# EAGLE design MicroLRS (EAGLE 7.5.0)
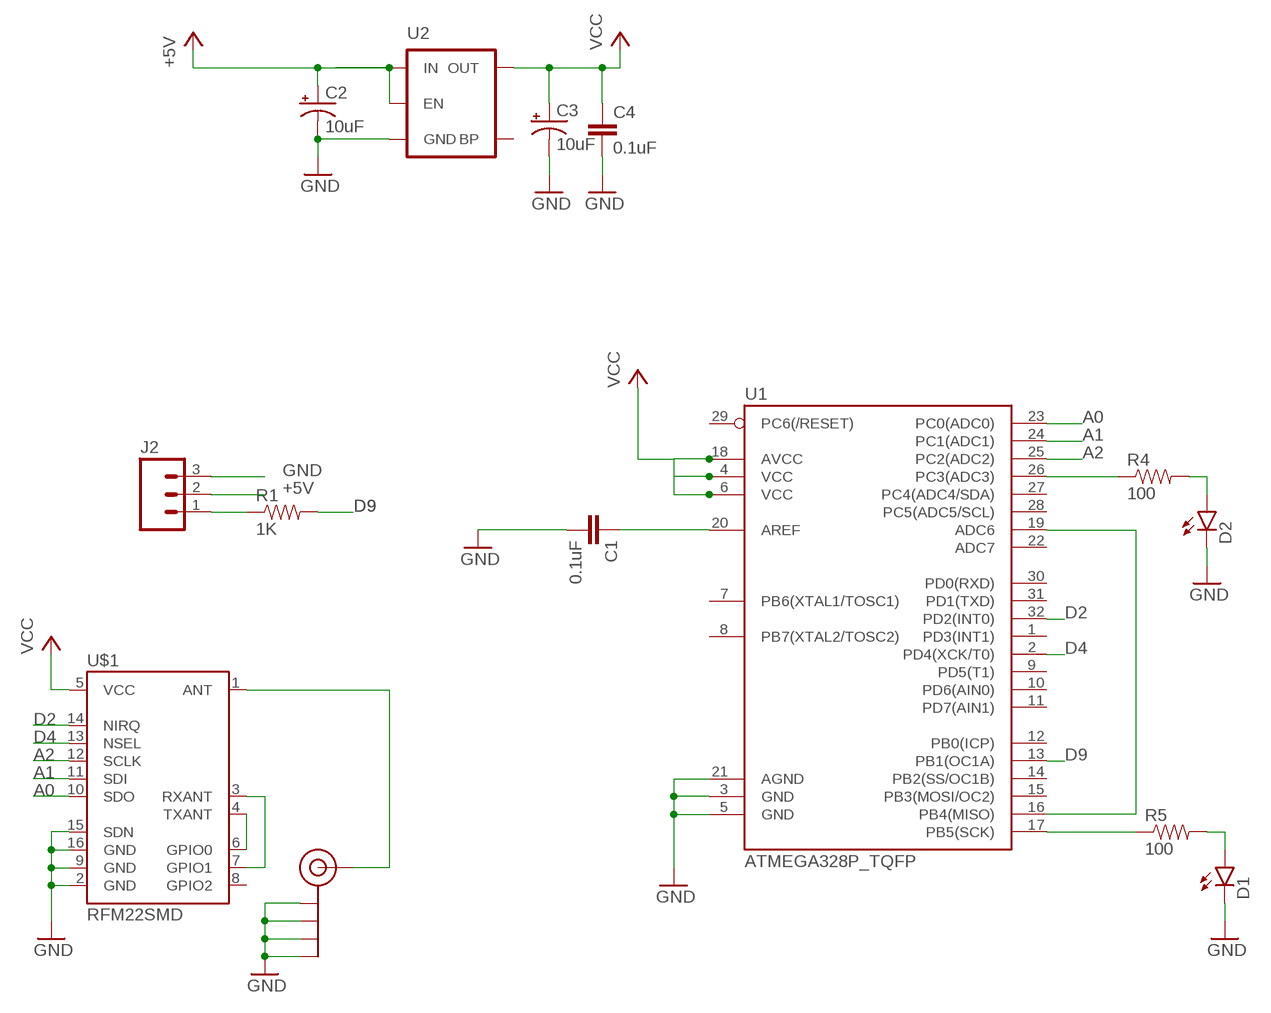
[diagram p0: schematic, sheet 1]

## Parts
C1  0.1uF  0.1UF-16V(+-10%)(0402)  [0402-CAP]
C2  10uF  10UF-6.3V-20%(0603)(TANT)"  [0603-POL]
C3  10uF  10UF-6.3V-20%(0603)(TANT)"  [0603-POL]
C4  0.1uF  0.1UF-25V-5%(0603)  [0603-CAP]
D1  LED0603  [LED-0603]
D2  LED0603  [LED-0603]
J2  M03PTH  [1X03]
J$1  SMA_EDGE  [SMA-EDGE]
R1  1K  1KOHM-1/10W-1%(0603)  [0603-RES]
R4  100  100OHM-1/10W-1%(0603)  [0603-RES]
R5  100  100OHM-1/10W-1%(0603)  [0603-RES]
U1  ATMEGA328P_TQFP  [TQFP32-08]
U2  MIC52053.3V  [SOT23-5]
U$1  RFM22SMD  [RFM22-XXX-S2]

## Nets
+5V: C2.A(+) J2.2 U2.1(IN) U2.3(EN)
A0: U1.23(PC0(ADC0)) U$1.10(SDO)
A1: U1.24(PC1(ADC1)) U$1.11(SDI)
A2: U1.25(PC2(ADC2)) U$1.12(SCLK)
D2: U1.32(PD2(INT0)) U$1.14(NIRQ)
D4: U1.2(PD4(XCK/T0)) U$1.13(NSEL)
D9: R1.2 U1.13(PB1(OC1A))
GND: C1.2 C2.K(-) C3.K(-) C4.2 D1.C D2.C J2.3 J$1.GND@0(GND) J$1.GND@1(GND) J$1.GND@2(GND) J$1.GND@3(GND) U1.3(GND) U1.5(GND) U1.21(AGND) U2.2(GND) U$1.2(GND) U$1.9(GND) U$1.15(SDN) U$1.16(GND)
N$1: C1.1 U1.20(AREF)
N$2: J$1.SIG(SIGNAL) U$1.1(ANT)
N$3: U$1.4(TXANT) U$1.6(GPIO0)
N$4: U$1.3(RXANT) U$1.7(GPIO1)
N$9: U1.16(PB4(MISO)) U1.19(ADC6)
N$10: J2.1 R1.1
N$11: R4.1 U1.26(PC3(ADC3))
N$12: R5.1 U1.17(PB5(SCK))
N$13: D2.A R4.2
N$14: D1.A R5.2
VCC: C3.A(+) C4.1 U1.4(VCC) U1.6(VCC) U1.18(AVCC) U2.5(OUT) U$1.5(VCC)
Unconnected: U1.1(PD3(INT1)) U1.7(PB6(XTAL1/TOSC1)) U1.8(PB7(XTAL2/TOSC2)) U1.9(PD5(T1)) U1.10(PD6(AIN0)) U1.11(PD7(AIN1)) U1.12(PB0(ICP)) U1.14(PB2(SS/OC1B)) U1.15(PB3(MOSI/OC2)) U1.22(ADC7) U1.27(PC4(ADC4/SDA)) U1.28(PC5(ADC5/SCL)) U1.29(PC6(/RESET)) U1.30(PD0(RXD)) U1.31(PD1(TXD)) U2.4(BP) U$1.8(GPIO2)

## Library data of the parts
C1 = SparkFun-Capacitors:0.1UF-16V(+-10%)(0402); PROD_ID: CAP-12416
C2 C3 = SparkFun-Capacitors:10UF-6.3V-20%(0603)(TANT); PROD_ID: CAP-13210
C4 = SparkFun-Capacitors:0.1UF-25V-5%(0603): CAP-08604; PROD_ID: CAP-08604
D1 D2 = SparkFun-LED:LED: LEDs Standard schematic elements and footprints for 5mm, 3mm, 1206, and 0603 sized LEDs. 5mm - Spark Fun Electronics SKU : COM-00529 (and others)
J2 = SparkFun-Connectors:M03: Header 3 Standard 3-pin 0.1" header. Use with straight break away headers (SKU : PRT-00116), right angle break away headers (PRT-00553), swiss pins (PRT-00743), machine pins (PRT-00117), and female headers (PRT-00115). Molex polarized connector foot print use with SKU : PRT-08232 with associated crimp pins and housings.
J$1 = SparkFun-Connectors:SMA_EDGE: SMA Antenna Connector End launch SMA connector. The paste layer has been removed so that the connector can be hand soldered onto the board after reflow.
R1 = SparkFun-Resistors:1KOHM-1/10W-1%(0603): RES-07856; PROD_ID: RES-07856
R4 R5 = SparkFun-Resistors:100OHM-1/10W-1%(0603): RES-07863; PROD_ID: RES-07863
U1 = SparkFun-DigitalIC:ATMEGA328P_TQFP; PROD_ID: IC-09069
U2 = SparkFun-PowerIC:MIC5205: MIC5205 150mA vreg 3.3V - VREG-00822 5V - VREG-00823; PROD_ID: VREG-00822
U$1 = SparkFun-RF:RFM22: The RFM22 is a low-power, low cost radio that is capable of operating in the 434MHz and 900MHz open bands. It's frequency is software defined and there are some very good libraries written for it.

## Board
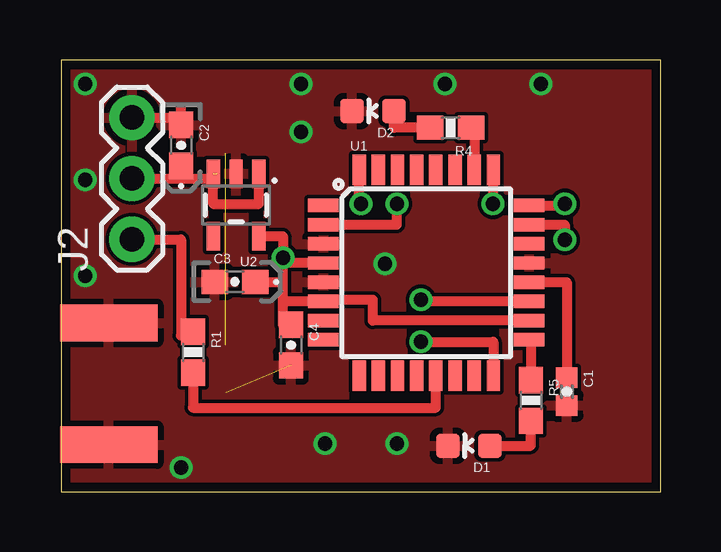
[diagram p1: board, top side]
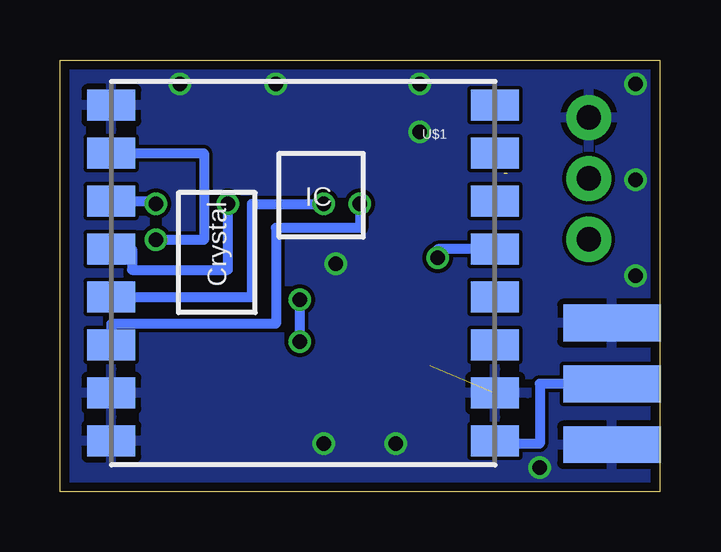
[diagram p2: board, bottom side, seen from below]

Size 25 x 18 mm. Coordinates in mm from the lower left corner, seen from the top.
Outline: 0,0 25,0 25,18 0,18 0,0
Copper layers (1*16): Top 0.0356mm / dielectric 1.5011mm / Bottom 0.0356mm
Design rules "LaenPCBOrder": minimum track width 6mil, minimum drill 13mil, track to track 6mil, track to pad 6mil, pad to pad 6mil, via to via 6mil, smd to smd 6mil, copper to edge 15mil, drill to drill 6mil, minimum pad ring 7mil, minimum via ring 7mil, stop-mask expansion 3mil, vias tented up to drill 0mil, thermal gap 10mil

### Footprints (pad centres in the part's own frame; a part is rotated, then mirrored left to right if it is on the bottom)
0402-CAP = smd 0.85 x 0.9: 1 -0.58,0; 2 0.58,0
0603-POL = smd 1.1 x 1: A 0.85,0; K -0.85,0
0603-CAP = smd 1.1 x 1: 1 -0.85,0; 2 0.85,0
LED-0603 = smd 1 x 1: A 0,-0.877; C 0,0.877
1X03 = drill 1.016 pad 1.88: 1 0,0; 2 2.54,0; 3 5.08,0
SMA-EDGE = smd 1.524 x 4.064: GND@0 0,0; GND@1 5.08,0; SIG 2.54,0 | smd 1.524 x 4.064 bottom: GND@2 0,0; GND@3 5.08,0
0603-RES = smd 1.1 x 1: 1 -0.85,0; 2 0.85,0
TQFP32-08 = smd 1.27 x 0.559: 1 -4.293,2.8; 2 -4.293,2; 3 -4.293,1.2; 4 -4.293,0.4; 5 -4.293,-0.4; 6 -4.293,-1.2; 7 -4.293,-2; 8 -4.293,-2.8; 17 4.293,-2.8; 18 4.293,-2; 19 4.293,-1.2; 20 4.293,-0.4; 21 4.293,0.4; 22 4.293,1.2; 23 4.293,2; 24 4.293,2.8 | smd 0.559 x 1.27: 9 -2.8,-4.293; 10 -2,-4.293; 11 -1.2,-4.293; 12 -0.4,-4.293; 13 0.4,-4.293; 14 1.2,-4.293; 15 2,-4.293; 16 2.8,-4.293; 25 2.8,4.293; 26 2,4.293; 27 1.2,4.293; 28 0.4,4.293; 29 -0.4,4.293; 30 -1.2,4.293; 31 -2,4.293; 32 -2.8,4.293
SOT23-5 = smd 0.55 x 1.2: 1 -0.95,-1.3; 2 0,-1.3; 3 0.95,-1.3; 4 0.95,1.3; 5 -0.95,1.3
RFM22-XXX-S2 = smd 2 x 1.3: 1 -8,7; 2 -8,5; 3 -8,3; 4 -8,1; 5 -8,-1; 6 -8,-3; 7 -8,-5; 8 -8,-7; 9 8,-7; 10 8,-5; 11 8,-3; 12 8,-1; 13 8,1; 14 8,3; 15 8,5; 16 8,7

### Placement (x,y rotation side)
C1  21.08,4.17 270 top
C2  5,14.44 270 top
C3  7.25,8.75 0 top
C4  9.58,6.11 270 top
D1  17,1.91 90 top
D2  13,15.87 90 top
J2  2.95,10.52 90 top
J$1  1.98,1.95 90 bottom
R1  5.5,5.81 270 top
R4  16.24,15.17 180 top
R5  19.58,3.8 270 top
U1  15.22,9.13 0 top
U2  7.29,11.95 180 top
U$1  14.86,9.11 180 bottom

### Tracks (layer width: path | path; a pad name or v marks a point on that pad's centre or on a via)
+5V  (1 unrouted)
  Top 0.406: U2.1 8.24,12 6.34,12 U2.3 6.34,13.06 J2.2 5,13.06 C2.A
A0  (via drill 0.6 pad 0.25)
  Top 0.406: U1.23 21,11.13 v21,10.5
  Bottom 0.406: U$1.10 19,14.11 19,10.5 v21,10.5
A1  (via drill 0.6 pad 0.25)
  Top 0.406: U1.24 21,11.93 v21,12
  Bottom 0.406: U$1.11 21,12.11 v21,12
A2  (via drill 0.6 pad 0.25)
  Top 0.406: U1.25 18,13.42 v18,12
  Bottom 0.406: U$1.12 22,10.11 22,9.25 18,9.25 v18,12
D2  (via drill 0.6 pad 0.25)
  Top 0.406: v12.5,12 12.42,12 U1.32
  Bottom 0.406: v12.5,12 12.5,11 16,11 16,7 22.86,7 U$1.14
D4  (via drill 0.6 pad 0.25)
  Top 0.406: U1.2 14,11.13 v14,12
  Bottom 0.406: U$1.13 17,8.11 17,12 v14,12
D9
  Top 0.406: R1.2 5.5,3.5 15.62,3.5 U1.13
GND  (via drill 0.6 pad 0.25)  (1 unrouted)
  Top 0.406: J2.3 5,15.6 5,16
  other vias: 5,1 11,2 14,2 1,17 1,13 1,9 10,17 10,15 16,17 20,17 13.5,9.5
  pour Top: 0,18 25,18 25,0 0,0
  pour Bottom: 0,0 25,0 25,18 0,18
N$1
  Top 0.406: U1.20 21.08,8.73 C1.1
N$2
  Bottom 0.406: J$1.SIG 5,4.49 5,2 6.86,2 U$1.1
N$3  (1 unrouted)
N$4  (1 unrouted)
N$9  (via drill 0.6 pad 0.25)
  Top 0.406: U1.19 15,7.93 v15,8 | v15,6.25 18.02,6.25 U1.16
  Bottom 0.406: v15,6.25 v15,8
N$10
  Top 0.406: J2.1 5,10.52 5,6.5 5.5,6.5 R1.1
N$11
  Top 0.406: R4.1 17.22,15.17 U1.26
N$12
  Top 0.406: U1.17 19.58,6.33 R5.1
N$13
  Top 0.406: R4.2 13.88,15.17 D2.A
N$14
  Top 0.406: D1.A 19.58,1.91 R5.2
VCC  (via drill 0.6)
  Top 0.406: U1.4 9.25,9.53 v9.25,9.75 | C3.A 9.25,8.75 v9.25,9.75 | 9.25,7.93 U1.6 10.93,8 13,8 13,7.13 U1.18 | 9.25,7.93 v9.25,9.75 | U2.5 9.25,10.65 v9.25,9.75 | C4.1 9.25,6.96 9.25,7.93
  Bottom 0.406: U$1.5 9.25,10.11 v9.25,9.75